# Altium schematic sheet Input_Digital.SchDoc
size A4
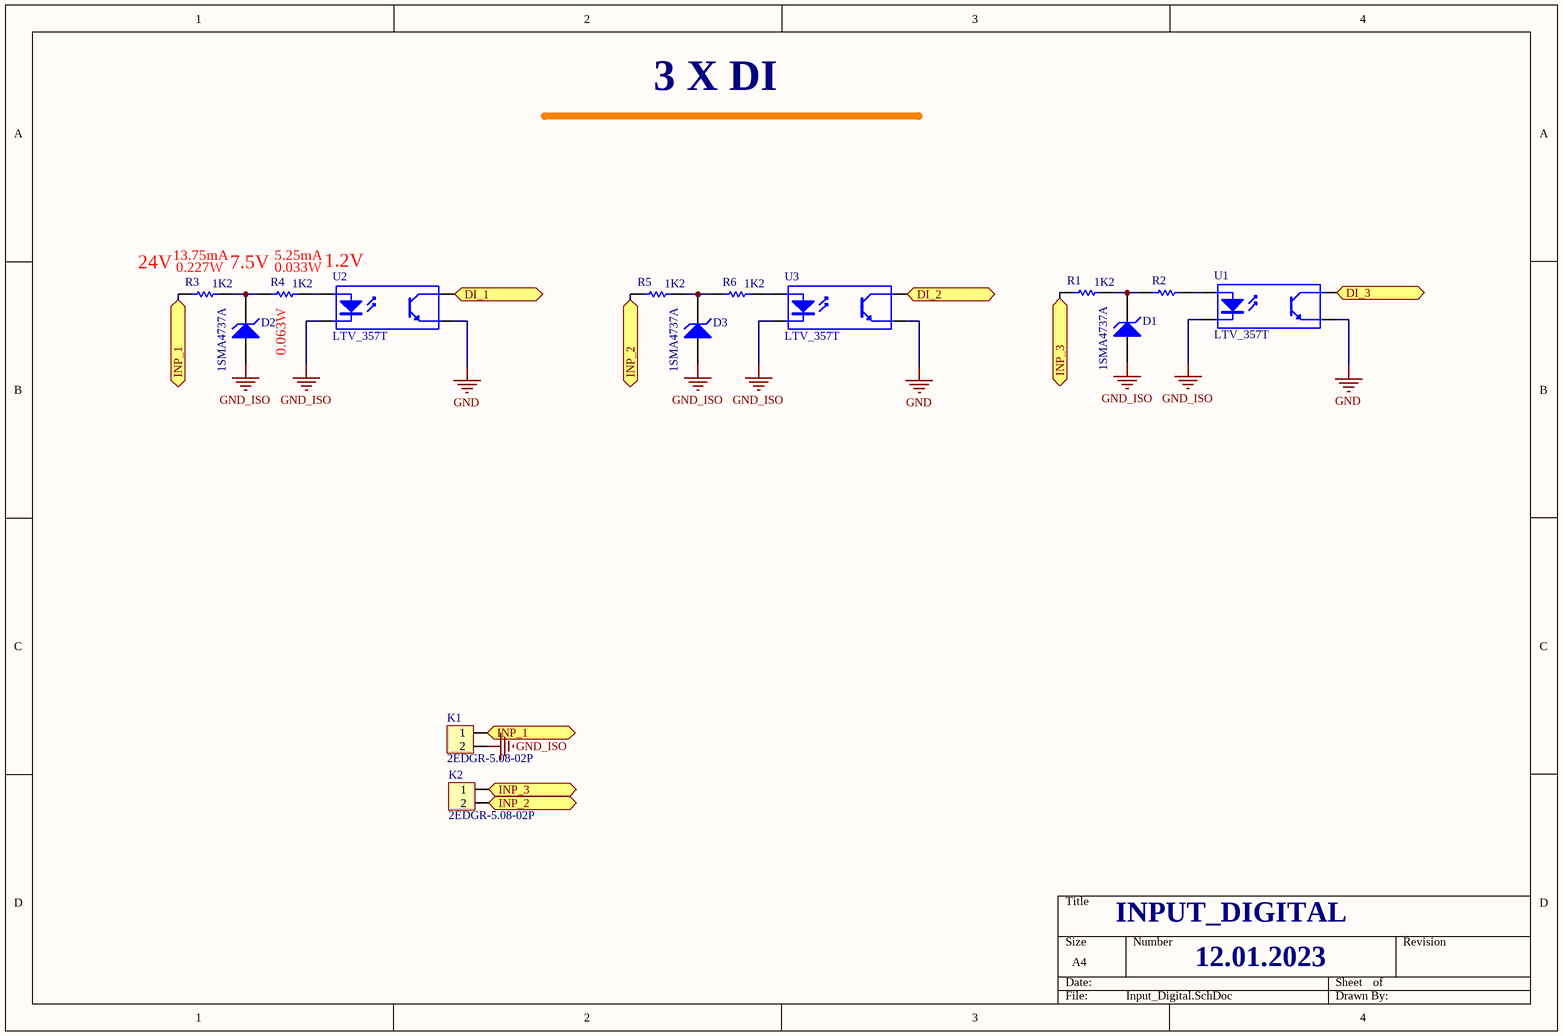
[diagram p0: Input_Digital.SchDoc]

## Parts
D1  1SMA4737A  [DO214AC]
D2  1SMA4737A  [DO214AC]
D3  1SMA4737A  [DO214AC]
K1  2EDGR-5.08-02P  [CON_DG129_02P]
K2  2EDGR-5.08-02P  [CON_DG129_02P]
R1  1K2  [RES3216[1206]]
R2  1K2  [RES2012[0805]]  (value not drawn)
R3  1K2  [RES3216[1206]]
R4  1K2  [RES2012[0805]]
R5  1K2  [RES3216[1206]]
R6  1K2  [RES2012[0805]]
U1  LTV_357T  [SMD-4]
U2  LTV_357T  [SMD-4]
U3  LTV_357T  [SMD-4]

## Ports
DI_1, DI_2, DI_3, INP_1, INP_2, INP_3

## Nets
GND: U1.3(E) U2.3(E) U3.3(E)
GND_ISO: D1.1(A) D2.1(A) D3.1(A) K1.2 U1.2(K) U2.2(K) U3.2(K)
DI_1: U2.4(C) ; port DI_1
DI_2: U3.4(C) ; port DI_2
DI_3: U1.4(C) ; port DI_3
INP_1: K1.1 R3.2 ; port INP_1
INP_2: K2.2 R5.2 ; port INP_2
INP_3: K2.1 R1.2 ; port INP_3
NetD1_2: D1.2(K) R1.1 R2.2
NetD2_2: D2.2(K) R3.1 R4.2
NetD3_2: D3.2(K) R5.1 R6.2
NetR2_1: R2.1 U1.1(A)
NetR4_1: R4.1 U2.1(A)
NetR6_1: R6.1 U3.1(A)

## Notes on the sheet
- 3 X DI
- (near R3) 24V
- (near R3) 13.75mA
- (near R3) 0.227W
- 7.5V
- 5.25mA
- 0.033W
- 1.2V
- 0.063W
- INPUT_DIGITAL
- 12.01.2023

## Library data of the parts
D1-D3 = DIODE: DIODE Zener Diode 7.5V 1W DO214AC; Published: 8-Jun-2000; LatestRevisionDate: 17-Jul-2002; LatestRevisionNote: Re-released for DXP Platform.; PackageReference: DIODE-0.7; Publisher: Altium Limited
K1 K2 = KLEMENS_2P: CONNECTOR 5.08mm 2PIN 90DEG
R1 R3 R5 = RES: RESISTOR 1206 Case %1; Value: 430R; Published: 8-Jun-2000; LatestRevisionDate: 17-Jul-2002; LatestRevisionNote: Re-released for DXP Platform.; PackageReference: AXIAL-0.5; Publisher: Altium Limited
R2 R4 R6 = RES: RESISTOR 0805 Case %1; Value: 430R; Published: 8-Jun-2000; LatestRevisionDate: 17-Jul-2002; LatestRevisionNote: Re-released for DXP Platform.; PackageReference: AXIAL-0.5; Publisher: Altium Limited
U1-U3 = LVT_357T: OPTOCOUPLER Transistor Output Optocouplers Optocoupler Phototrans; Published: 24-Mar-1999; LatestRevisionDate: 04-Mar-2005; LatestRevisionNote: Sch pins 3 & 4 Swapped.; DatasheetDocument: Nov-2003; PackageReference: DIP-4; Publisher: Altium Limited